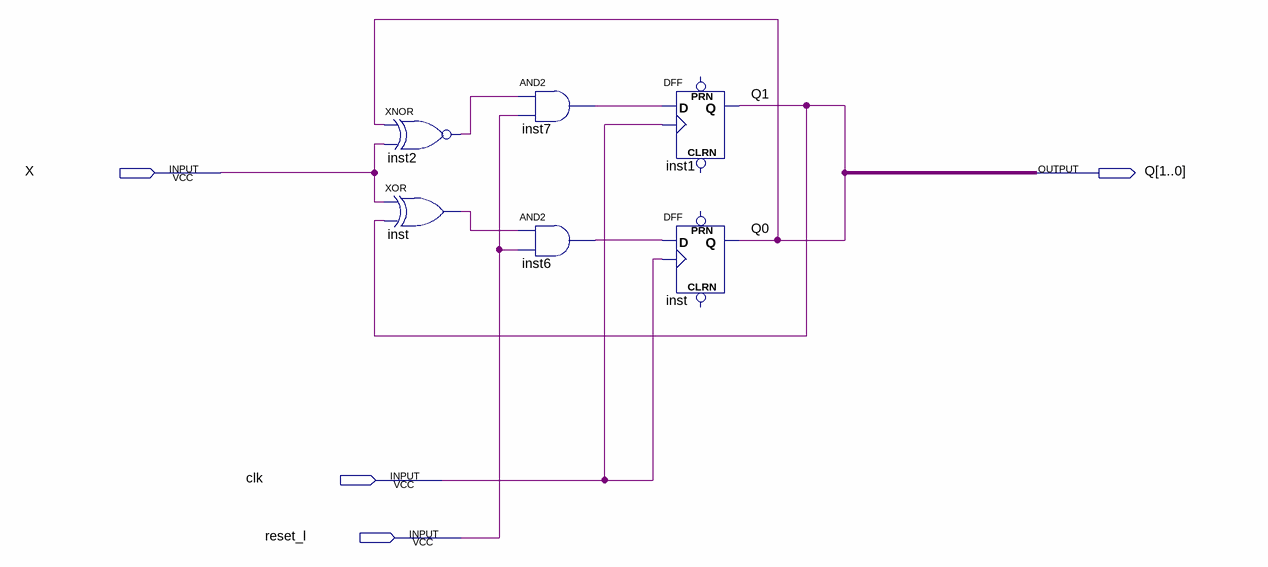
[diagram p0: schematic sheet]
// Quartus schematic 1.bdf as structural Verilog: 6 symbols, 4 pins
module \1  (
  input  X,
  input  clk,
  input  reset_l,
  output [1:0] Q
);

  wire inst2_out, inst6_out, inst7_out, inst_out;

  xnor inst2 (inst2_out, Q[0], X);
  xor inst (inst_out, X, Q[1]);
  and inst7 (inst7_out, inst2_out, reset_l);
  and inst6 (inst6_out, inst_out, reset_l);
  DFF inst1 (.CLK(clk), .D(inst7_out), .Q(Q[1]));  // open: CLRN, PRN
  DFF inst_dup2 (.CLK(clk), .D(inst6_out), .Q(Q[0]));  // open: CLRN, PRN
endmodule
